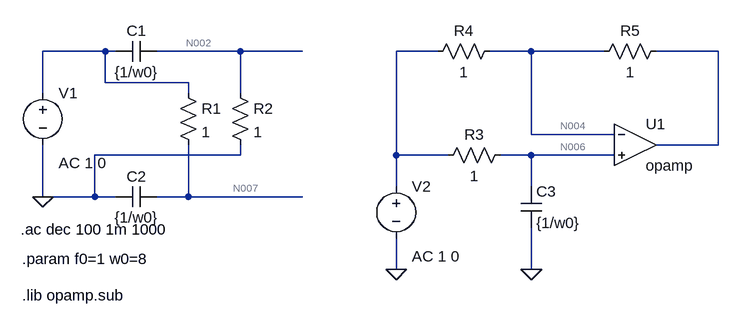
[diagram p0: schematic 1.asc]
1.asc, the LTspice schematic file:
Version 4
SHEET 1 1128 680
WIRE 80 80 -16 80
WIRE 96 80 80 80
WIRE 288 80 160 80
WIRE 384 80 288 80
WIRE 592 80 528 80
WIRE 736 80 672 80
WIRE 848 80 736 80
WIRE 1024 80 928 80
WIRE 80 128 80 80
WIRE 208 128 80 128
WIRE -16 144 -16 80
WIRE 208 144 208 128
WIRE 288 144 288 80
WIRE 736 208 736 80
WIRE 864 208 736 208
WIRE 1024 224 1024 80
WIRE 1024 224 928 224
WIRE 288 240 288 224
WIRE 288 240 64 240
WIRE 528 240 528 80
WIRE 608 240 528 240
WIRE 736 240 688 240
WIRE 864 240 736 240
WIRE 528 288 528 240
WIRE 736 288 736 240
WIRE -16 304 -16 224
WIRE 64 304 64 240
WIRE 64 304 -16 304
WIRE 96 304 64 304
WIRE 208 304 208 224
WIRE 208 304 160 304
WIRE 384 304 208 304
WIRE 528 416 528 368
WIRE 736 416 736 352
FLAG -16 304 0
FLAG 736 416 0
FLAG 528 416 0
SYMBOL voltage -16 128 R0
WINDOW 123 24 124 Left 2
WINDOW 39 0 0 Left 0
SYMATTR InstName V1
SYMATTR Value ""
SYMATTR Value2 AC 1 0
SYMBOL cap 160 64 R90
WINDOW 0 0 32 VBottom 2
WINDOW 3 32 32 VTop 2
SYMATTR InstName C1
SYMATTR Value {1/w0}
SYMBOL cap 160 288 R90
WINDOW 0 0 32 VBottom 2
WINDOW 3 32 32 VTop 2
SYMATTR InstName C2
SYMATTR Value {1/w0}
SYMBOL res 192 128 R0
SYMATTR InstName R1
SYMATTR Value 1
SYMBOL res 272 128 R0
SYMATTR InstName R2
SYMATTR Value 1
SYMBOL res 704 224 R90
WINDOW 0 0 56 VBottom 2
WINDOW 3 32 56 VTop 2
SYMATTR InstName R3
SYMATTR Value 1
SYMBOL cap 720 288 R0
SYMATTR InstName C3
SYMATTR Value {1/w0}
SYMBOL voltage 528 272 R0
WINDOW 123 24 124 Left 2
WINDOW 39 0 0 Left 0
SYMATTR InstName V2
SYMATTR Value ""
SYMATTR Value2 AC 1 0
SYMBOL res 688 64 R90
WINDOW 0 0 56 VBottom 2
WINDOW 3 32 56 VTop 2
SYMATTR InstName R4
SYMATTR Value 1
SYMBOL res 944 64 R90
WINDOW 0 0 56 VBottom 2
WINDOW 3 32 56 VTop 2
SYMATTR InstName R5
SYMATTR Value 1
SYMBOL OpAmps\\opamp 896 160 R0
SYMATTR InstName U1
TEXT -50 354 Left 2 !.ac dec 100 1m 1000
TEXT -48 400 Left 2 !.param f0=1 w0=8
TEXT -48 456 Left 2 !.lib opamp.sub

The netlist it stands for:
* 1.asc
V1 N001 0 AC 1 0
C1 N002 N001 {1/w0}
C2 N007 0 {1/w0}
R1 N001 N007 1
R2 N002 0 1
R3 N006 N003 1
C3 N006 0 {1/w0}
V2 N003 0 AC 1 0
R4 N004 N003 1
R5 N005 N004 1
XU1 N004 N006 N005 opamp Aol=100K GBW=10Meg  ; pins invin noninvin out
.ac dec 100 1m 1000
.param f0=1 w0=8
.lib opamp.sub
.backanno
.end

* Results of the author's LTspice run, read from the files saved beside the schematic
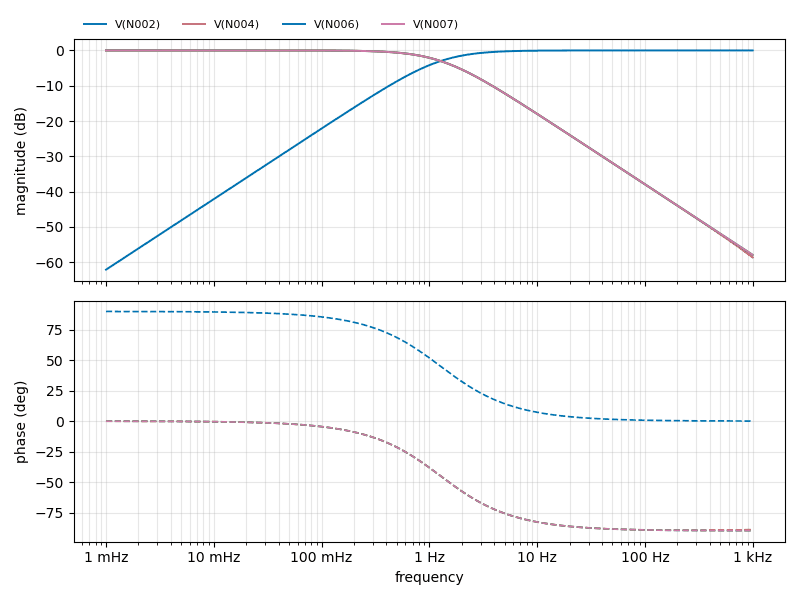
[diagram p1: AC Analysis of 1.asc, plotted from the saved traces]
* AC Analysis, 1 run:
*   V(N002): -62.10 dB at 1 mHz, -0.00 dB at 1 kHz, peak -0.00 dB at 1 kHz, 3 dB below the peak at 1.273 Hz
*   V(N004): -0.00 dB at 1 mHz, -58.61 dB at 1 kHz, peak -0.00 dB at 1 mHz, 3 dB below the peak at 1.273 Hz
*   V(N006): -0.00 dB at 1 mHz, -57.90 dB at 1 kHz, peak -0.00 dB at 1 mHz, 3 dB below the peak at 1.273 Hz
*   V(N007): -0.00 dB at 1 mHz, -57.90 dB at 1 kHz, peak -0.00 dB at 1 mHz, 3 dB below the peak at 1.273 Hz